# EAGLE schematic KMO_IO_MV2 (EAGLE 9.1.3)

## Sheet 1 of 2
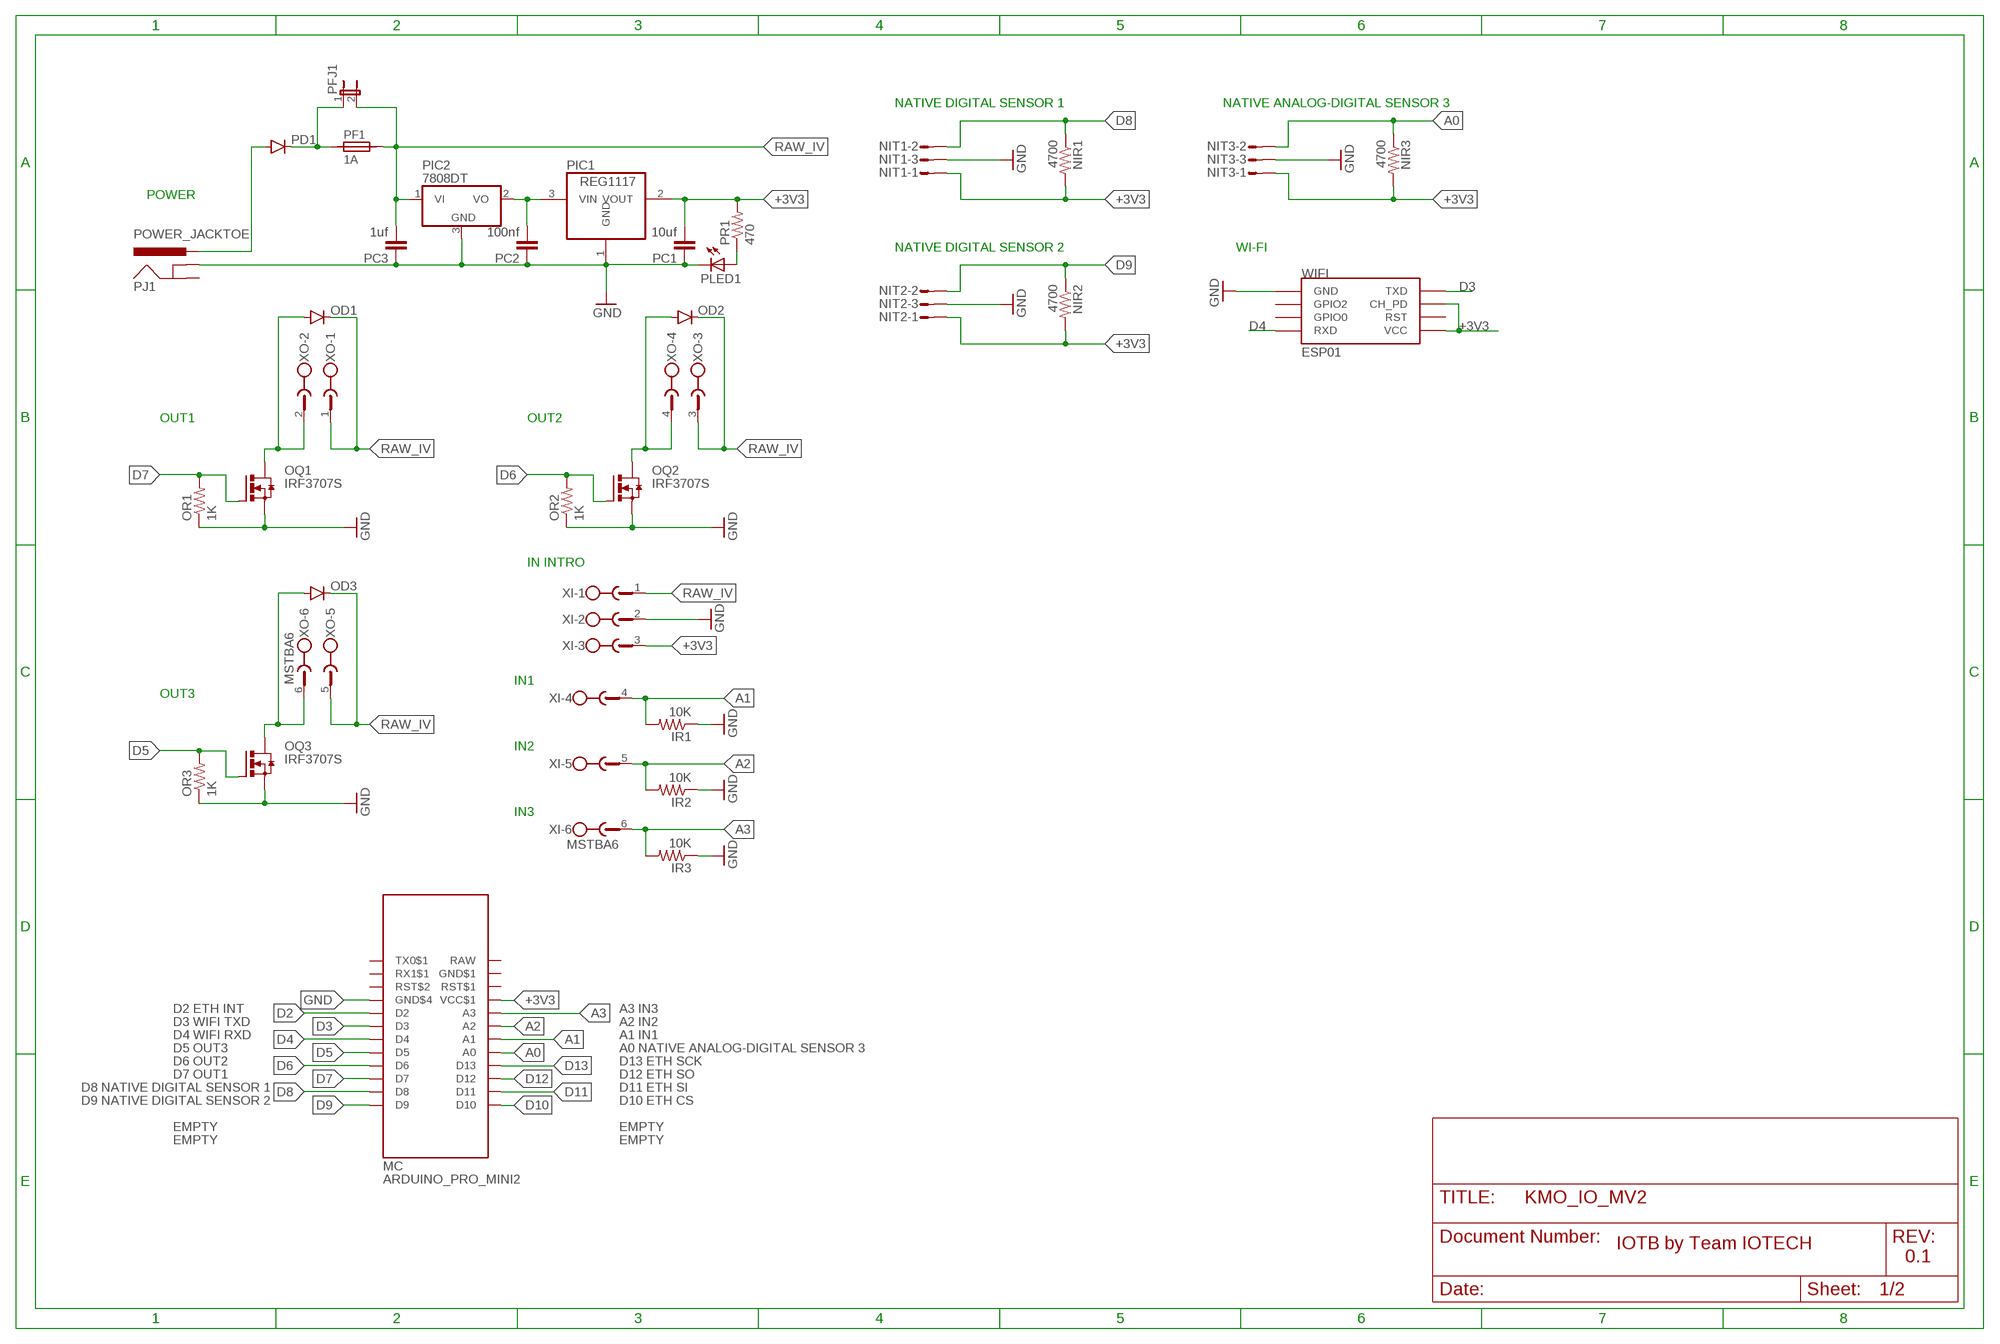
[diagram p0: schematic, sheet 1]

### Parts
IR1  10K  RESISTOR0805-RES  [0805]
IR2  10K  RESISTOR0805-RES  [0805]
IR3  10K  RESISTOR0805-RES  [0805]
MC  ARDUINO_PRO_MINI2  [ARDUINO_PRO_MINI2]
NIR1  4700  RESISTOR0805-RES  [0805]
NIR2  4700  RESISTOR0805-RES  [0805]
NIR3  4700  RESISTOR0805-RES  [0805]
NIT1  S03P  [S03P]
NIT2  S03P  [S03P]
NIT3  S03P  [S03P]
OD1  DIODESMA  [SMA-DIODE]
OD2  DIODESMA  [SMA-DIODE]
OD3  DIODESMA  [SMA-DIODE]
OQ1  IRF3707S  IRF3704S  [D2PACK]
OQ2  IRF3707S  IRF3704S  [D2PACK]
OQ3  IRF3707S  IRF3704S  [D2PACK]
OR1  1K  RESISTOR0805-RES  [0805]
OR2  1K  RESISTOR0805-RES  [0805]
OR3  1K  RESISTOR0805-RES  [0805]
PC1  10uf  CAP0805  [0805]
PC2  100nf  CAP0805  [0805]
PC3  1uf  CAP0805  [0805]
PD1  DIODESMA  [SMA-DIODE]
PF1  1A  SIBA194600  [1820]
PFJ1  JP1E  [JP1]
PIC1  REG1117  [SOT223]
PIC2  7808DT  [TO252]
PJ1  POWER_JACKTOE  [POWER_JACK_SMD_OVERPASTE_TOE]
PLED1  LEDCHIP-LED0805  [CHIP-LED0805]
PR1  470  RESISTOR0805-RES  [0805]
WIFI  ESP01  [ESP01]
XI  MSTBA6  [MSTBA6]
XO  MSTBA6  [MSTBA6]

### Nets
+3V3: MC.VCC$1 NIR1.2 NIR2.2 NIR3.2 NIT1.1 NIT2.1 NIT3.1 PC1.2 PIC1.2(VOUT) PR1.2 WIFI.CH_PD WIFI.VCC XI.3 ; also sheet 2
A0: MC.A0 NIR3.1 NIT3.2
A1: IR1.2 MC.A1 XI.4
A2: IR2.2 MC.A2 XI.5
A3: IR3.2 MC.A3 XI.6
D2: MC.D2 ; also sheet 2
D3: MC.D3 WIFI.TX(TXD)
D4: MC.D4 WIFI.RX(RXD)
D5: MC.D5 OQ3.1(G) OR3.2
D6: MC.D6 OQ2.1(G) OR2.2
D7: MC.D7 OQ1.1(G) OR1.2
D8: MC.D8 NIR1.1 NIT1.2
D9: MC.D9 NIR2.1 NIT2.2
D10: MC.D10 ; also sheet 2
D11: MC.D11 ; also sheet 2
D12: MC.D12 ; also sheet 2
D13: MC.D13 ; also sheet 2
GND: IR1.1 IR2.1 IR3.1 MC.GND$4 NIT1.3 NIT2.3 NIT3.3 OQ1.3(S) OQ2.3(S) OQ3.3(S) OR1.1 OR2.1 OR3.1 PC1.1 PC2.1 PC3.1 PIC1.1(GND) PIC2.3(GND) PJ1.GND(GNDBREAK) PLED1.C WIFI.GND XI.2 ; also sheet 2
N$1: OD3.A OQ3.2(D) XO.6
N$2: PD1.C PF1.1 PFJ1.1
N$3: OD1.A OQ1.2(D) XO.2
N$4: OD2.A OQ2.2(D) XO.4
N$7: PD1.A PJ1.VIN0(PWR)
N$11: PLED1.A PR1.1
N$12: PC2.2 PIC1.3(VIN) PIC2.2(VO)
RAW_IV [v]: OD1.C OD2.C OD3.C PC3.2 PF1.2 PFJ1.2 PIC2.1(VI) XI.1 XO.1 XO.3 XO.5
Unconnected: MC.RST$1 MC.RST$2 MC.RX1$1 MC.TX0$1 PJ1.P$4(GND) WIFI.GPIO0 WIFI.GPIO2 WIFI.RST

### Notes on the sheet
- NATIVE DIGITAL SENSOR 1 | NATIVE ANALOG-DIGITAL SENSOR 3
- POWER
- NATIVE DIGITAL SENSOR 2 | WI-FI
- OUT1 | OUT2
- IN INTRO
- IN1
- OUT3
- IN2
- IN3
- D2 ETH INT | A3 IN3
- D3 WIFI TXD | A2 IN2
- D4 WIFI RXD | A1 IN1
- D5 OUT3 | A0 NATIVE ANALOG-DIGITAL SENSOR 3
- D6 OUT2 | D13 ETH SCK
- D7 OUT1 | D12 ETH SO
- D8 NATIVE DIGITAL SENSOR 1 | D11 ETH SI
- D9 NATIVE DIGITAL SENSOR 2 | D10 ETH CS
- EMPTY | EMPTY
- EMPTY | EMPTY
- IOTB by Team IOTECH
- 0.1

## Sheet 2 of 2
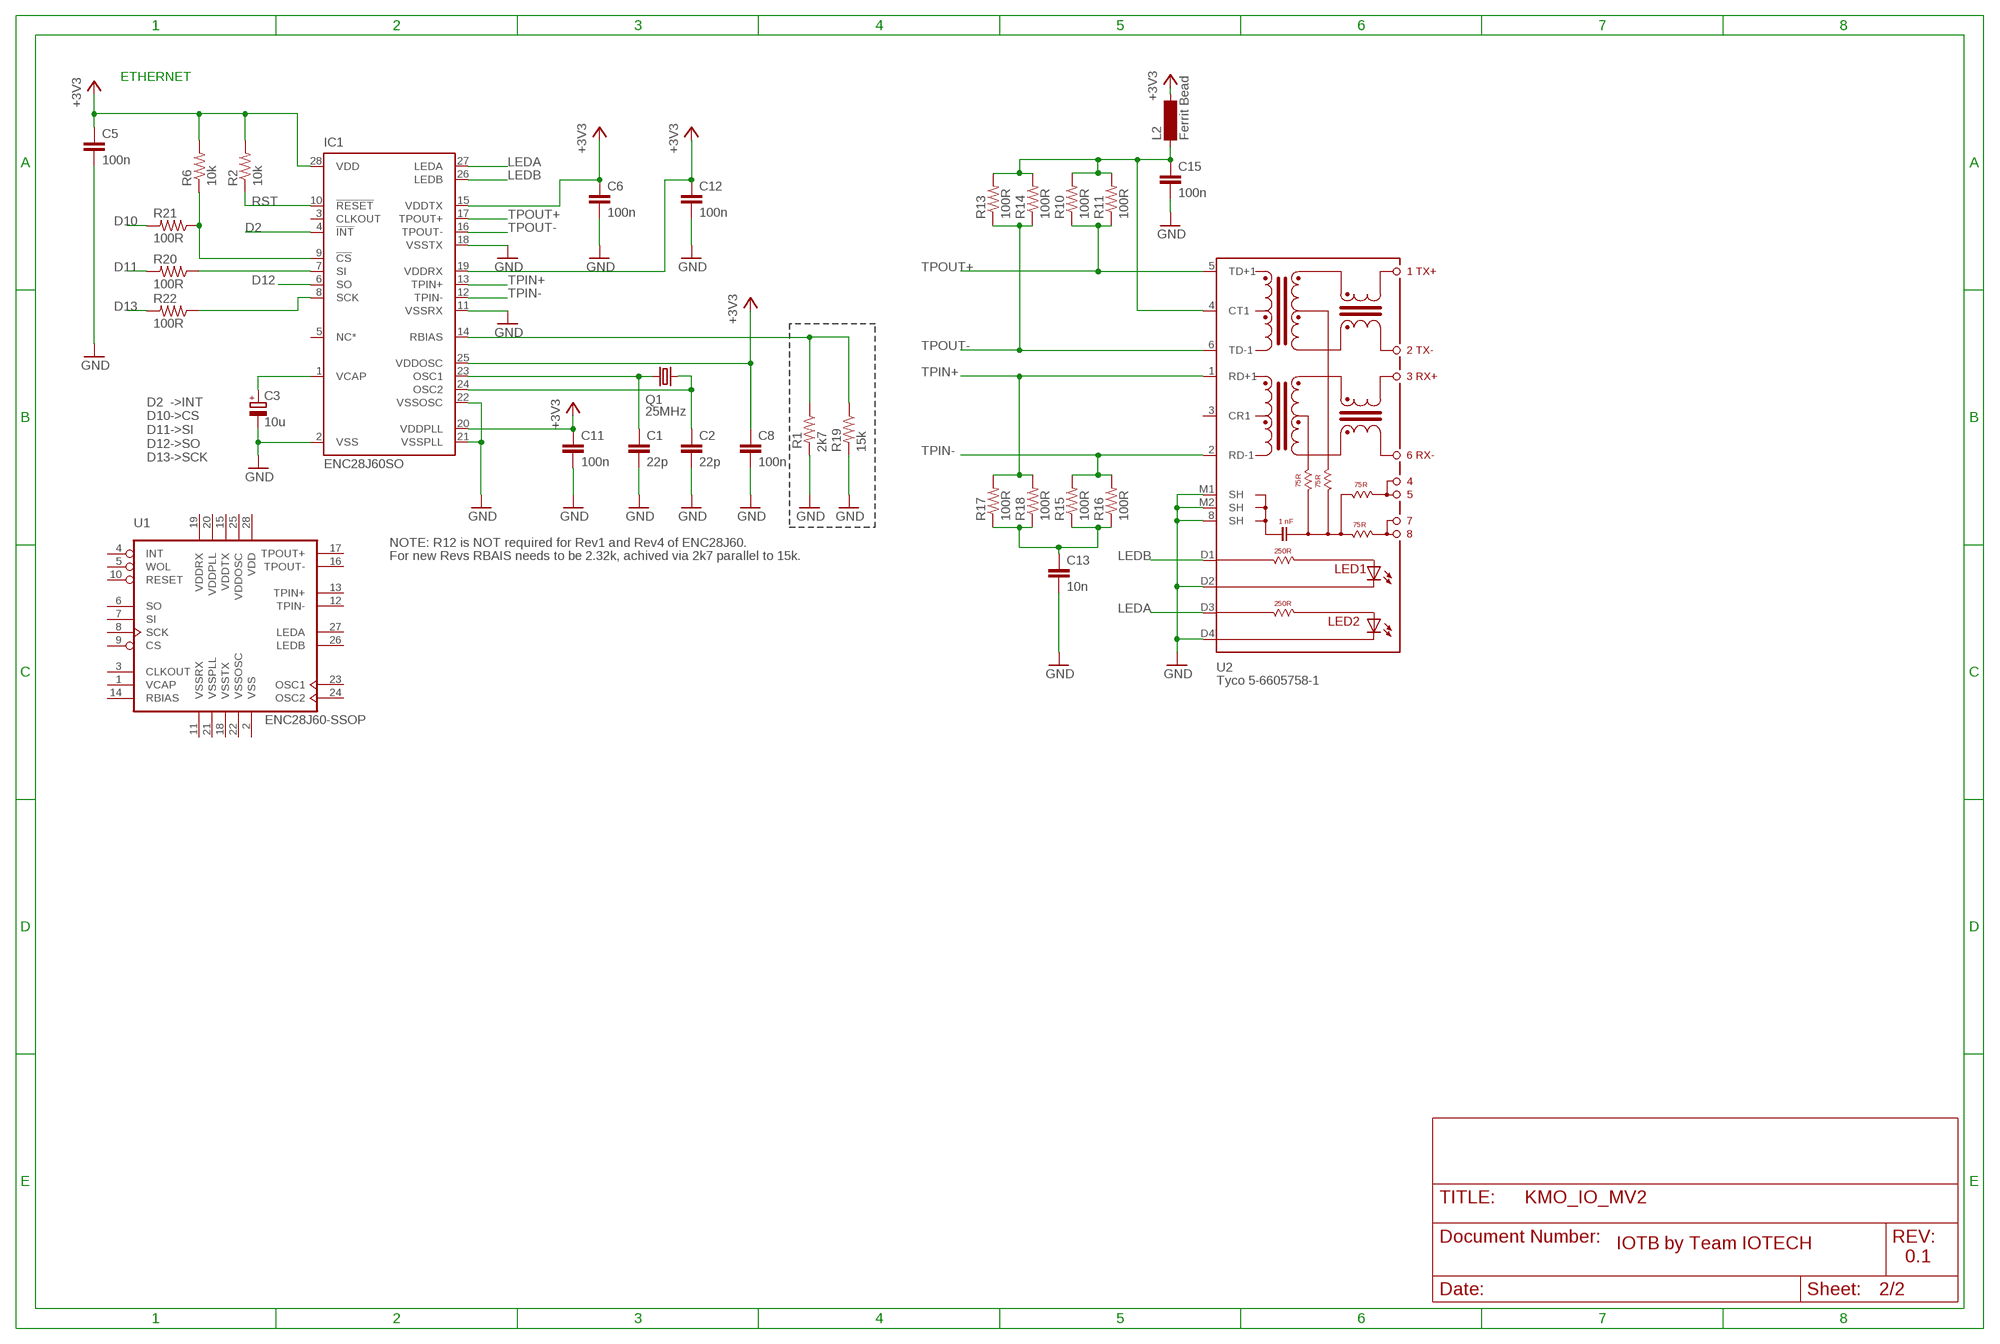
[diagram p1: schematic, sheet 2]

### Parts
C1  22p  CAP0805  [0805]
C2  22p  CAP0805  [0805]
C3  10u  CPOL-EUE2.5-5  [E2,5-5]
C5  100n  CAP0805  [0805]
C6  100n  CAP0805  [0805]
C8  100n  CAP0805  [0805]
C11  100n  CAP0805  [0805]
C12  100n  CAP0805  [0805]
C13  10n  CAP0805  [0805]
C15  100n  CAP0805  [0805]
IC1  ENC28J60SO  [SO28W]
L2  Ferrit Bead  SM-1206  [SM-1206]
Q1  25MHz  CRYSTALHC49S  [HC49/S]
R1  2k7  RESISTOR0805-RES  [0805]
R2  10k  RESISTOR0805-RES  [0805]
R6  10k  RESISTOR0805-RES  [0805]
R10  100R  RESISTOR0805-RES  [0805]
R11  100R  RESISTOR0805-RES  [0805]
R13  100R  RESISTOR0805-RES  [0805]
R14  100R  RESISTOR0805-RES  [0805]
R15  100R  RESISTOR0805-RES  [0805]
R16  100R  RESISTOR0805-RES  [0805]
R17  100R  RESISTOR0805-RES  [0805]
R18  100R  RESISTOR0805-RES  [0805]
R19  15k  RESISTOR0805-RES  [0805]
R20  100R  RESISTOR0805-RES  [0805]
R21  100R  RESISTOR0805-RES  [0805]
R22  100R  RESISTOR0805-RES  [0805]
U1  ENC28J60-SSOP  [SSOP28]
U2  Tyco 5-6605758-1  5-6605758-1  [5-6605758-1]

### Nets
+3V3: C5.1 C6.1 C8.1 C11.1 C12.1 IC1.15(VDDTX) IC1.19(VDDRX) IC1.20(VDDPLL) IC1.25(VDDOSC) IC1.28(VDD) L2.2 R2.2 R6.2 ; also sheet 1
D2: IC1.4(!INT) ; also sheet 1
D10: R21.2 ; also sheet 1
D11: R20.2 ; also sheet 1
D12: IC1.6(SO) ; also sheet 1
D13: R22.2 ; also sheet 1
GND: C1.2 C2.2 C3.- C5.2 C6.2 C8.2 C11.2 C12.2 C13.2 C15.2 IC1.2(VSS) IC1.11(VSSRX) IC1.18(VSSTX) IC1.21(VSSPLL) IC1.22(VSSOSC) R1.2 R19.2 U2.8(SH) U2.D2 U2.D4 U2.M1(SH) U2.M2(SH) ; also sheet 1
LEDA: IC1.27(LEDA) U2.D3
LEDB: IC1.26(LEDB) U2.D1
N$5: C1.1 IC1.23(OSC1) Q1.1
N$6: C2.1 IC1.24(OSC2) Q1.2
N$8: C3.+ IC1.1(VCAP)
N$9: IC1.14(RBIAS) R1.1 R19.1
N$10: C13.1 R15.1 R16.1 R17.1 R18.1
N$16: C15.1 L2.1 R10.2 R11.2 R13.2 R14.2 U2.4(CT1)
N$20: IC1.7(SI) R20.1
N$21: IC1.9(!CS) R6.1 R21.1
N$23: IC1.8(SCK) R22.1
RST: IC1.10(!RESET) R2.1
TPIN+: IC1.13(TPIN+) R17.2 R18.2 U2.1(RD+1)
TPIN-: IC1.12(TPIN-) R15.2 R16.2 U2.2(RD-1)
TPOUT+: IC1.17(TPOUT+) R10.1 R11.1 U2.5(TD+1)
TPOUT-: IC1.16(TPOUT-) R13.1 R14.1 U2.6(TD-1)
Unconnected: IC1.3(CLKOUT) IC1.5(NC*) U1.3(CLKOUT) U1.4(INT) U1.5(WOL) U1.6(SO) U1.7(SI) U1.8(SCK) U1.9(CS) U1.10(RESET) U1.12(TPIN-) U1.13(TPIN+) U1.14(RBIAS) U1.16(TPOUT-) U1.17(TPOUT+) U1.23(OSC1) U1.24(OSC2) U1.26(LEDB) U1.27(LEDA) U2.3(CR1)

### Notes on the sheet
- ETHERNET
- D2  ->INT
  D10->CS
  D11->SI
  D12->SO
  D13->SCK
- NOTE: R12 is NOT required for Rev1 and Rev4 of ENC28J60.
- For new Revs RBAIS needs to be 2.32k, achived via 2k7 parallel to 15k.
- IOTB by Team IOTECH
- 0.1

## Power pins joined to a net without a drawn wire
GND$1: MC.GDN$1(GND$1)
RAW: MC.RAW
VCAP: U1.1(VCAP)
VDD: U1.28(VDD)
VDDOSC: U1.25(VDDOSC)
VDDPLL: U1.20(VDDPLL)
VDDRX: U1.19(VDDRX)
VDDTX: U1.15(VDDTX)
VSS: U1.2(VSS)
VSSOSC: U1.22(VSSOSC)
VSSPLL: U1.21(VSSPLL)
VSSRX: U1.11(VSSRX)
VSSTX: U1.18(VSSTX)

## Library data of the parts
C1 C2 C5 C6 C8 C11-C13 C15 = SparkFun-Passives:CAP: Capacitor Standard 0603 ceramic capacitor, and 0.1" leaded capacitor.
C3 = rcl:CPOL-EU: POLARIZED CAPACITOR, European symbol
IC1 = microchip-6:ENC28J60: Stand-Alone Ethernet Controller with SPI Interface Source: http://ww1.microchip.com/downloads/en/DeviceDoc/39662c.pdf
IR1-IR3 NIR1-NIR3 OR1-OR3 PR1 R1 R2 R6 R10 R11 R13-R22 = SparkFun-Passives:RESISTOR: Resistor Basic schematic elements and footprints for 0603, 1206, and PTH resistors.
L2 = inductor-neosid:SM-1206: INDUCTOR SMD chip inductor
MC = personal_srgPersonal:ARDUINO_PRO_MINI2
NIT1-NIT3 = con-amp-mt:S03P: AMP MT CONNECTOR; OC_FARNELL: unknown; OC_NEWARK: unknown
OD1-OD3 PD1 = SparkFun-DiscreteSemi:DIODE: Diode These are standard reverse protection diodes and small signal diodes. SMA package can handle up to about 1A. SOD-323 can handle about 200mA. What the SOD-323 package when ordering, there are some mfgs out there that are 5-pin packages.
OQ1-OQ3 = transistor-power:IRF3704: SMPS MOSFET HEXFET® Power MOSFET Source: http://www.irf.com/product-info/datasheets/data/irf3704.pdf
PC1-PC3 = SparkFun-Capacitors:CAP: Capacitor Standard 0603 ceramic capacitor, and 0.1" leaded capacitor.
PF1 = _hhn_PtcFuses_Siba_r500_Ozan:SIBA194600*: SIBA PTC-Fuses, Series 194600, 1812 (4.5 3.2)mm Source: www.siba.de/ Package: SMD 1812 (4.5 x 3.2)mm Technologies: SIBA194600Axxx xxx: Trip-Current * 10 mA Author: Dipl.-Ing. FH Rainer Bayer
PFJ1 = jumper:JP1E: JUMPER
PIC1 = burr-brown:REG1117: 800mA and 1A Low Dropout (LDO) Positive Regulator 1.8V, 2.5V, 2.85V, 3.3V, 5V, and Adj; MPN: REG1117; OC_FARNELL: 1097566; OC_NEWARK: 14P6981
PIC2 = linear:78*: Positive VOLTAGE REGULATOR Source: http://cache.national.com/ds/LM/LM78L05.pdf http://www.fairchildsemi.com/ds/LM/LM7805.pdf
PJ1 = SparkFun-Connectors:POWER_JACK: Power Jack Connector This is the standard 5.5mm barrel jack for power. The PTH is the most common, proven, reliable, footprint. The Slot footprint only works if the mill layer is transmitted to the PCB fab house so be warned. Here are the connectors we sell at SparkFun: DC Barrel Power Jack/Connector <https://www.sparkfun.com/products/119> (PRT-00119) DC Barrel Power Jack/Connector (SMD) <https://www.sparkfun.com/products/12748> (PRT-12748) DC Barrel Jack Adapter - Breadboard Compatible <https://www.sparkfun.com/products/10811> (PRT-10811) It is used on this SparkFun product (and many, many others): SparkFun RedBoard - Programmed with Arduino <https://www.sparkfun.com/products/12757> (DEV-12757) Also, if you need a mating power supply or connector, please check these out: Wall Adapter Power Supply - 9VDC 650mA <https://www.sparkfun.com/products/298> (TOL-00298) DC Barrel Jack Adapter - Male <https://www.sparkfun.com/products/10287> (PRT-10287); PROD_ID: CONN-08106; SF_ID: PRT-12748
PLED1 = led:LED: LED OSRAM: - CHIPLED LG R971, LG N971, LY N971, LG Q971, LY Q971, LO R971, LY R971 LH N974, LH R974 LS Q976, LO Q976, LY Q976 LO Q996 - Hyper CHIPLED LW Q18S LB Q993, LB Q99A, LB R99A - SideLED LS A670, LO A670, LY A670, LG A670, LP A670 LB A673, LV A673, LT A673, LW A673 LH A674 LY A675 LS A676, LA A676, LO A676, LY A676, LW A676 LS A679, LY A679, LG A679 - Hyper Micro SIDELED® LS Y876, LA Y876, LO Y876, LY Y876 LT Y87S - SmartLED LW L88C, LW L88S LB L89C, LB L89S, LG L890 LS L89K, LO L89K, LY L89K LS L896, LA L896, LO L896, LY L896 - TOPLED LS T670, LO T670, LY T670, LG T670, LP T670 LSG T670, LSP T670, LSY T670, LOP T670, LYG T670 LG T671, LOG T671, LSG T671 LB T673, LV T673, LT T673, LW T673 LH T674 LS T676, LA T676, LO T676, LY T676, LB T676, LH T676, LSB T676, LW T676 LB T67C, LV T67C, LT T67C, LS T67K, LO T67K, LY T67K, LW E67C LS E67B, LA E67B, LO E67B, LY E67B, LB E67C, LV E67C, LT E67C LW T67C LS T679, LY T679, LG T679 LS T770, LO T770, LY T770, LG T770, LP T770 LB T773, LV T773, LT T773, LW T773 LH T774 LS E675, LA E675, LY E675, LS T675 LS T776, LA T776, LO T776, LY T776, LB T776 LHGB T686 LT T68C, LB T68C - Hyper Mini TOPLED® LB M676 - Mini TOPLED Santana® LG M470 LS M47K, LO M47K, LY M47K Source: http://www.osram.convergy.de LUXEON: - LUMILED® LXK2-PW12-R00, LXK2-PW12-S00, LXK2-PW14-U00, LXK2-PW14-V00 LXK2-PM12-R00, LXK2-PM12-S00, LXK2-PM14-U00 LXK2-PE12-Q00, LXK2-PE12-R00, LXK2-PE12-S00, LXK2-PE14-T00, LXK2-PE14-U00 LXK2-PB12-K00, LXK2-PB12-L00, LXK2-PB12-M00, LXK2-PB14-N00, LXK2-PB14-P00, LXK2-PB14-Q00 LXK2-PR12-L00, LXK2-PR12-M00, LXK2-PR14-Q00, LXK2-PR14-R00 LXK2-PD12-Q00, LXK2-PD12-R00, LXK2-PD12-S00 LXK2-PH12-R00, LXK2-PH12-S00 LXK2-PL12-P00, LXK2-PL12-Q00, LXK2-PL12-R00 Source: www.luxeon.com KINGBRIGHT: KA-3528ASYC Source: www.kingbright.com
Q1 = crystal:CRYSTAL: CRYSTAL
U1 = microchip-enc28j60:ENC28J60-*: Microchip 10Mbit Eth. contoller with SPI interface
U2 = con-tycoelectronics-1:5-6605758-1
WIFI = esp8266modules:ESP01: ESP8266 Wifi module 01
XI XO = con-phoenix-508:MSTBA6: PHOENIX; MF: FARNELL; MPN: 1757284; OC_FARNELL: 3705213; OC_NEWARK: 71C4165

## Net classes
1 v: width 0.3 mm, drill 0.5 mm, clearance 0.25 mm